# Altium schematic sheet MotoAVC - Aquisição e IHM.SchDoc: MotoAVC v1.0
size A4; Author: Felippe Kalil Mendonça; DrawnBy: Felippe Kalil Mendonça; Organization: LABSOLDA/UFSC; Address1: Campus Universitário; Address2: Trindade - Florianópolis - SC; Address3: Brasil; DocumentNumber: 1.0; SheetNumber: 1; SheetTotal: 1; ProjectName: MotoAVC
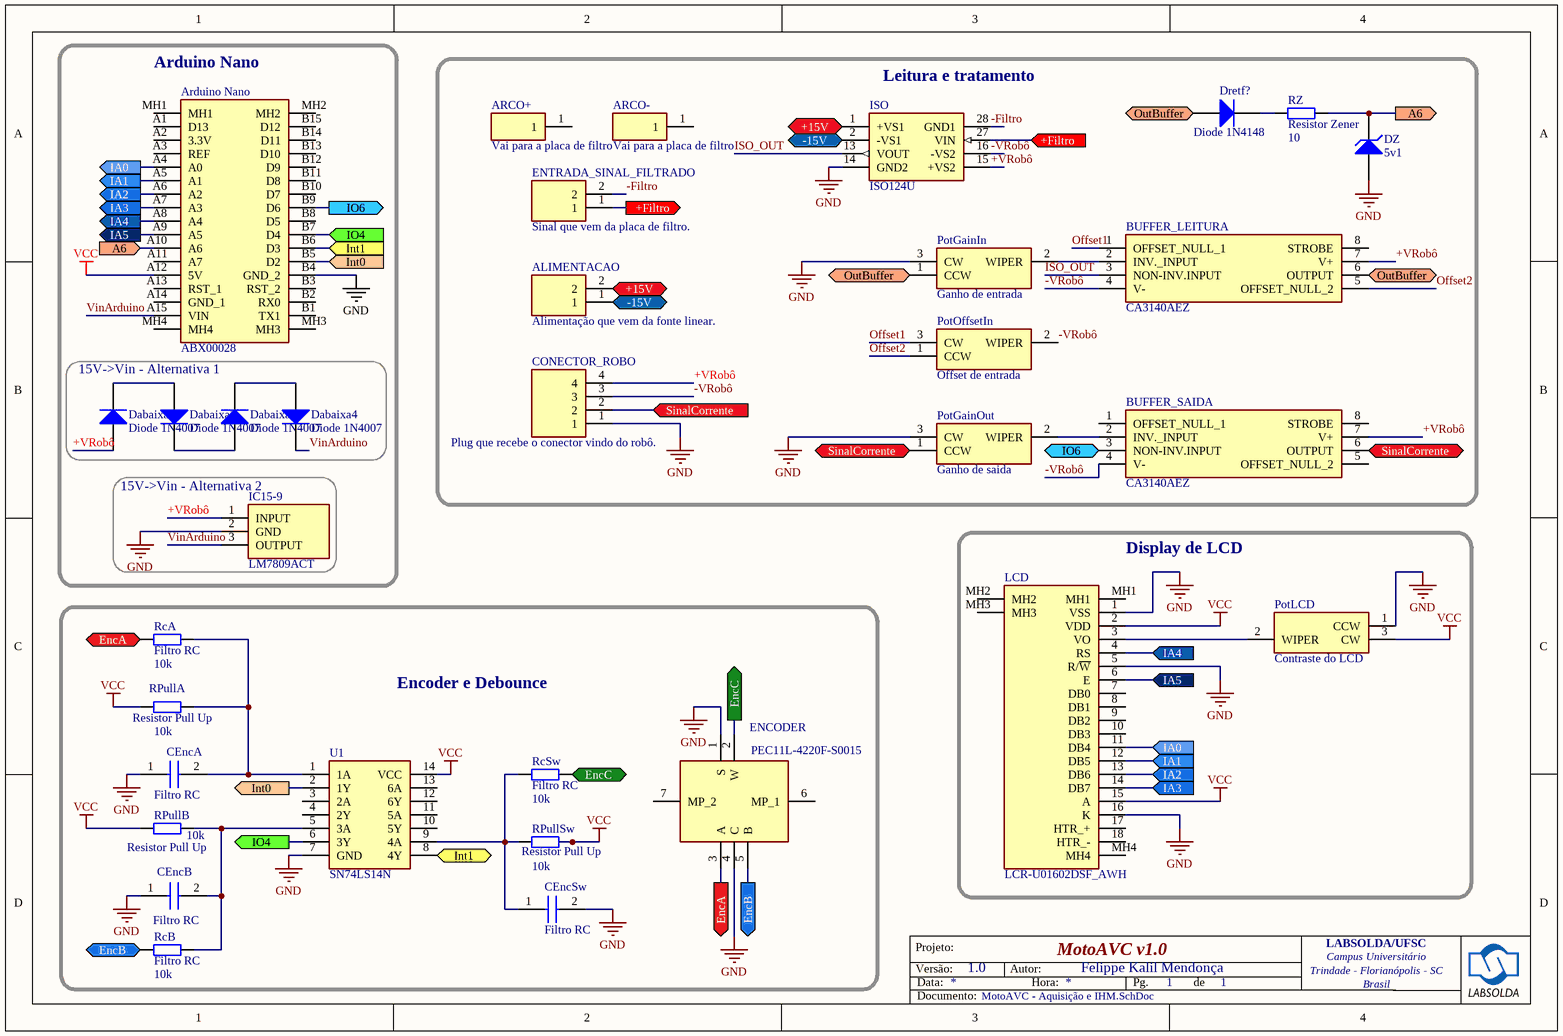
[diagram p0: MotoAVC - Aquisição e IHM.SchDoc]

## Parts
ALIMENTACAO  Alimentação que vem da fonte linear.  [SHDR2W104P0X254_1X2_508X580X1205P]
ARCO+  Vai para a placa de filtro  [CT22320]
ARCO-  Vai para a placa de filtro  [CT22320]
Arduino_Nano  ABX00028  [ABX00028]
BUFFER_LEITURA  CA3140AEZ  [DIP794W56P254L958H533Q8N]
BUFFER_SAIDA  CA3140AEZ  [DIP794W56P254L958H533Q8N]
CEncA  Filtro RC  [R82DC4100DQ60J]
CEncB  Filtro RC  [R82DC4100DQ60J]
CEncSw  Filtro RC  [R82DC4100DQ60J]
CONECTOR_ROBO  Plug que recebe o conector vindo do robô.  [SHDR4W87P0X254_1X4_1001X635X1091P]
Dabaixa1  Diode 1N4007  [DO-41]
Dabaixa2  Diode 1N4007  [DO-41]
Dabaixa3  Diode 1N4007  [DO-41]
Dabaixa4  Diode 1N4007  [DO-41]
Dretf?  Diode 1N4148  [DO-35]
DZ  5v1  [DIODE-0.7]
ENCODER  PEC11L-4220F-S0015  [PEC11L4220FS0015]
ENTRADA_SINAL_FILTRADO  Sinal que vem da placa de filtro.  [SHDR2W104P0X254_1X2_508X580X1205P]
IC15-9  LM7809ACT  [TO254P470X1016X2019-3P]
ISO  ISO124U  [ISO122U]
LCD  LCR-U01602DSF_AWH  [LCRU01602DSFAWH]
PotGainIn  Ganho de entrada  [3386F1153]
PotGainOut  Ganho de saida  [3386F1153]
PotLCD  Contraste do LCD  [3386F1153]
PotOffsetIn  Offset de entrada  [3386F1153]
RcA  Filtro RC  value 10k  [AXIAL-0.4]
RcB  Filtro RC  value 10k  [AXIAL-0.4]
RcSw  Filtro RC  value 10k  [AXIAL-0.4]
RPullA  Resistor Pull Up  value 10k  [AXIAL-0.4]
RPullB  Resistor Pull Up  value 10k  [AXIAL-0.4]
RPullSw  Resistor Pull Up  value 10k  [AXIAL-0.4]
RZ  Resistor Zener  value 10  [AXIAL-0.4]
U1  SN74LS14N  [DIP794W53P254L1930H508Q14N]

## Blocks framed on the sheet
Arduino Nano: Arduino_Nano
Leitura e tratamento: ALIMENTACAO ARCO+ ARCO- BUFFER_LEITURA BUFFER_SAIDA CONECTOR_ROBO Dretf? DZ ENTRADA_SINAL_FILTRADO ISO PotGainIn PotGainOut PotOffsetIn RZ
15V->Vin - Alternativa 1: Dabaixa1-Dabaixa4
15V->Vin - Alternativa 2: IC15-9
Display de LCD: LCD PotLCD
Encoder e Debounce: CEncA CEncB CEncSw ENCODER RcA RcB RcSw RPullA RPullB RPullSw U1

## Ports
+15V (in), +15V (out), +Filtro (in), +Filtro (out), -15V (in), -15V (out), A6 (in), A6 (out), EncA (in), EncA (out), EncB (in), EncB (out), EncC (in), EncC (out), IA0 (in), IA0 (out), IA1 (in), IA1 (out), IA2 (in), IA2 (out), IA3 (in), IA3 (out), IA4 (in), IA4 (out), IA5 (in), IA5 (out), Int0 (in), Int0 (out), Int1 (in), Int1 (out), IO4 (in), IO4 (out), IO6 (in), IO6 (out), OutBuffer (in), OutBuffer (out), SinalCorrente (in), SinalCorrente (out)

## Nets
GND: Arduino_Nano.B4(GND_2) CEncA.1 CEncB.1 CEncSw.2 CONECTOR_ROBO.1 DZ.1(A) ENCODER.1(S) ENCODER.4(C) IC15-9.2(GND) ISO.14(GND2) LCD.1(VSS) LCD.5(R/~{W}) LCD.16(K) PotGainIn.3(CW) PotGainOut.3(CW) PotLCD.1(CCW) U1.7(GND)
VCC: Arduino_Nano.A12(5V) LCD.2(VDD) LCD.15(A) PotLCD.3(CW) RPullA.1 RPullB.1 RPullSw.2 U1.14(VCC)
+15V: ALIMENTACAO.2 ISO.1(+VS1) ; port +15V
+Filtro: ENTRADA_SINAL_FILTRADO.1 ISO.27(VIN) ; port +Filtro
+VRobô: BUFFER_LEITURA.7(V+) BUFFER_SAIDA.7(V+) CONECTOR_ROBO.4 Dabaixa1.1(A) IC15-9.1(INPUT) ISO.15(+VS2)
-15V: ALIMENTACAO.1 ISO.2(-VS1) ; port -15V
-Filtro: ENTRADA_SINAL_FILTRADO.2 ISO.28(GND1)
-VRobô: BUFFER_LEITURA.4(V-) BUFFER_SAIDA.4(V-) CONECTOR_ROBO.3 ISO.16(-VS2) PotOffsetIn.2(WIPER)
A6: Arduino_Nano.A10(A6) DZ.2(K) RZ.2 ; port A6
EncA: ENCODER.3(A) RcA.2 ; port EncA
EncB: ENCODER.5(B) RcB.1 ; port EncB
EncC: ENCODER.2(W) RcSw.2 ; port EncC
IA0: Arduino_Nano.A4(A0) LCD.11(DB4) ; port IA0
IA1: Arduino_Nano.A5(A1) LCD.12(DB5) ; port IA1
IA2: Arduino_Nano.A6(A2) LCD.13(DB6) ; port IA2
IA3: Arduino_Nano.A7(A3) LCD.14(DB7) ; port IA3
IA4: Arduino_Nano.A8(A4) LCD.4(RS) ; port IA4
IA5: Arduino_Nano.A9(A5) LCD.6(E) ; port IA5
Int0: Arduino_Nano.B5(D2) U1.2(1Y) ; port Int0
Int1: Arduino_Nano.B6(D3) U1.8(4Y) ; port Int1
IO4: Arduino_Nano.B7(D4) U1.6(3Y) ; port IO4
IO6: Arduino_Nano.B9(D6) BUFFER_SAIDA.3(NON-INV.INPUT) ; port IO6
ISO_OUT: BUFFER_LEITURA.3(NON-INV.INPUT) ISO.13(VOUT)
Offset1: BUFFER_LEITURA.1(OFFSET_NULL_1) PotOffsetIn.3(CW)
Offset2: BUFFER_LEITURA.5(OFFSET_NULL_2) PotOffsetIn.1(CCW)
OutBuffer: BUFFER_LEITURA.6(OUTPUT) Dretf?.1(A) PotGainIn.1(CCW) ; port OutBuffer
SinalCorrente: BUFFER_SAIDA.6(OUTPUT) CONECTOR_ROBO.2 PotGainOut.1(CCW) ; port SinalCorrente
VinArduino: Arduino_Nano.A15(VIN) Dabaixa4.2(K) IC15-9.3(OUTPUT)
NetBUFFER_LEITURA_2: BUFFER_LEITURA.2(INV._INPUT) PotGainIn.2(WIPER)
NetBUFFER_SAIDA_2: BUFFER_SAIDA.2(INV._INPUT) PotGainOut.2(WIPER)
NetCEncA_2: CEncA.2 RcA.1 RPullA.2 U1.1(1A)
NetCEncB_2: CEncB.2 RcB.2 RPullB.2 U1.5(3A)
NetCEncSw_1: CEncSw.1 RcSw.1 RPullSw.1 U1.9(4A)
NetDabaixa1_2: Dabaixa1.2(K) Dabaixa2.1(A)
NetDabaixa2_2: Dabaixa2.2(K) Dabaixa3.1(A)
NetDabaixa3_2: Dabaixa3.2(K) Dabaixa4.1(A)
NetDretf?_2: Dretf?.2(K) RZ.1
NetLCD_3: LCD.3(VO) PotLCD.2(WIPER)

Not connected (* = marked no-connect by the designer): ARCO+ 1; ARCO- 1; Arduino_Nano A1(D13) A2(3.3V) A3(REF) A11(A7) A13(RST_1) A14(GND_1) B1(TX1) B2(RX0) B3(RST_2) B8(D5) B10(D7) B11(D8) B12(D9) B13(D10) B14(D11) B15(D12) MH1 MH2 MH3 MH4; BUFFER_LEITURA 8(STROBE); BUFFER_SAIDA 1(OFFSET_NULL_1) 5(OFFSET_NULL_2) 8(STROBE); ENCODER 6(MP_1) 7(MP_2); LCD 7(DB0) 8(DB1) 9(DB2) 10(DB3) 17(HTR_+) 18(HTR_-) MH1 MH2 MH3 MH4; U1 3(2A) 4(2Y) 10(5Y) 11(5A) 12(6Y) 13(6A)

## Notes on the sheet
- Versão:
- Projeto:
- Data:
- Autor:
- Hora:
- Pg.
- de
- Documento:

## Library data of the parts
ALIMENTACAO ENTRADA_SINAL_FILTRADO = 0022272021: Connector; Manufacturer_Name: Molex; Datasheet Link: https://www.molex.com/webdocs/datasheets/pdf/en-us/0022272021_PCB_HEADERS.pdf; Height: 12.05mm; Manufacturer_Part_Number: 0022272021; Mouser Part Number: N/A; Mouser Price/Stock: https://www.mouser.com/Search/Refine.aspx?Keyword=N%2FA
ARCO+ ARCO- = CT2232-0: Connector; Manufacturer_Name: Cal Test; Datasheet Link: http://www.caltestelectronics.com/images/attachments/CT2232_drawing.pdf; Height: 38.3mm; Manufacturer_Part_Number: CT2232-0; Mouser Part Number: 510-CT2232-0; Mouser Price/Stock: https://www.mouser.co.uk/ProductDetail/Cal-Test/CT2232-0?qs=vgjKjNJexThptfwlH17E%2Fw%3D%3D
Arduino_Nano = ABX00028: Integrated Circuit; Manufacturer_Name: Arduino; Datasheet Link: https://store.arduino.cc/arduino-nano-every; Height: 10mm; Manufacturer_Part_Number: ABX00028; Mouser Part Number: 782-ABX00028; Mouser Price/Stock: https://www.mouser.co.uk/ProductDetail/Arduino/ABX00028?qs=PzGy0jfpSMtit6rnFl8mVg%3D%3D; RS Part Number: 1927586; RS Price/Stock: http://uk.rs-online.com/web/p/products/1927586
BUFFER_LEITURA BUFFER_SAIDA = CA3140AEZ: Integrated Circuit; Manufacturer_Name: Renesas Electronics; Datasheet Link: https://www.renesas.com/en-us/www/doc/datasheet/ca3140-a.pdf; Height: 5.33mm; Manufacturer_Part_Number: CA3140AEZ; Mouser Part Number: 968-CA3140AEZ; Mouser Price/Stock: https://www.mouser.co.uk/ProductDetail/Renesas-Intersil/CA3140AEZ?qs=cbl4%252BYHJGOHUlWz8IZgCeg%3D%3D; RS Part Number: 9215563P; RS Price/Stock: http://uk.rs-online.com/web/p/products/9215563P
CEncA CEncB CEncSw = R82DC4100DQ60J: Capacitor; Manufacturer_Name: Kemet; Allied_Number: 70037793; Datasheet Link: https://content.kemet.com/datasheets/KEM_F3101_R82.pdf; Height: 10.1mm; Manufacturer_Part_Number: R82DC4100DQ60J; Mouser Part Number: 80-R82DC4100DQ60J; Mouser Price/Stock: https://www.mouser.co.uk/ProductDetail/KEMET/R82DC4100DQ60J?qs=06HLYMEcjuVd2Wr1NUYuhw%3D%3D; RS Part Number: 8708834; RS Price/Stock: http://uk.rs-online.com/web/p/products/8708834; Allied Price/Stock: https://www.alliedelec.com/kemet-r82dc4100dq60j/70037793/
CONECTOR_ROBO = 0022232041: Connector; Manufacturer_Name: Molex; Datasheet Link: http://www.molex.com/pdm_docs/sd/022232041_sd.pdf; Height: 10.91mm; Manufacturer_Part_Number: 0022232041; Mouser Part Number: N/A; Mouser Price/Stock: https://www.mouser.com/Search/Refine.aspx?Keyword=N%2FA
Dabaixa1-Dabaixa4 = Diode 1N4007: 1 Amp General Purpose Rectifier; Published: 8-Jun-2000; LatestRevisionDate: 17-Jul-2002; LatestRevisionNote: Re-released for DXP Platform.; DatasheetVersion: 1998; PackageVersion: Aug-1999; PackageReference: DO-41; Publisher: Altium Limited; PackageDescription: Diode, Axial; Body 5.2 x 2.7 mm (LxDia. max), Lead Dia. 0.86 mm (max); Code_JEDEC: DO-204-AL; ComponentLink1Description: Manufacturer Link; ComponentLink1URL: http://www.fairchildsemi.com/; ComponentLink2Description: Datasheet; ComponentLink2URL: http://www.fairchildsemi.com/ds/1N%2F1N4001.pdf
Dretf? = Diode 1N4148: High Conductance Fast Diode; Published: 8-Jun-2000; LatestRevisionDate: 17-Jul-2002; LatestRevisionNote: Re-released for DXP Platform.; DatasheetVersion: 1997; PackageReference: DO-35; Publisher: Altium Limited; PackageDescription: Diode, Axial; Body 3.8 x 1.9 mm (LxDia. max), Lead Dia. 0.53 mm (max); Code_JEDEC: DO-204-AH; ComponentLink1Description: Manufacturer Link; ComponentLink1URL: http://www.fairchildsemi.com/; ComponentLink2Description: Datasheet; ComponentLink2URL: http://www.fairchildsemi.com/ds/1N%2F1N4148.pdf
DZ = D Zener: Zener Diode; Published: 8-Jun-2000; LatestRevisionDate: 17-Jul-2002; LatestRevisionNote: Re-released for DXP Platform.; PackageReference: DIODE-0.7; Publisher: Altium Limited; PackageDescription: Diode, Thru-Hole; 2 Leads; 0.7 in Pin Spacing
ENCODER = PEC11L-4220F-S0015: Undefined or Miscellaneous; Manufacturer_Name: Bourns; Allied_Number: 70230668; Datasheet Link: https://www.bourns.com/PDFs/pec11l.pdf; Height: 25mm; Manufacturer_Part_Number: PEC11L-4220F-S0015; Mouser Part Number: 652-PEC11L4220FS0015; Mouser Price/Stock: https://www.mouser.co.uk/ProductDetail/Bourns/PEC11L-4220F-S0015?qs=Q4nXA9D1WFOSxqK3IduBbA%3D%3D; Allied Price/Stock: https://www.alliedelec.com/bourns-pec11l-4220f-s0015/70230668/
IC15-9 = LM7809ACT: Integrated Circuit; Manufacturer_Name: ON Semiconductor; Datasheet Link: https://www.mouser.com/datasheet/2/308/LM7809A-1306765.pdf; Height: 4.7mm; Manufacturer_Part_Number: LM7809ACT; Mouser Part Number: 512-LM7809ACT; Mouser Price/Stock: https://www.mouser.co.uk/ProductDetail/ON-Semiconductor-Fairchild/LM7809ACT?qs=VOMQJJE%252BBNnUX5YOd5%2Fz3w%3D%3D; RS Part Number: 8062845; RS Price/Stock: http://uk.rs-online.com/web/p/products/8062845
ISO = ISO124U: Integrated Circuit; Manufacturer_Name: Texas Instruments; Datasheet Link: http://www.ti.com/lit/ds/symlink/iso124.pdf; Height: 2.65mm; Manufacturer_Part_Number: ISO124U; Mouser Part Number: 595-ISO124U; Mouser Price/Stock: https://www.mouser.co.uk/ProductDetail/Texas-Instruments/ISO124U?qs=VBduBm9rCJQZw7ykoQ%2Fz8g%3D%3D; RS Part Number: 3008259P; RS Price/Stock: http://uk.rs-online.com/web/p/products/3008259P
LCD = LCR-U01602DSF_AWH: Display; Manufacturer_Name: Lumex; Manufacturer_Part_Number: LCR-U01602DSF/AWH; Allied_Number: 70127475; Datasheet Link: http://www.mouser.com/datasheet/2/244/LCR-U01602DSF_A-WH-1176207.pdf; Height: 12.8mm; Mouser Part Number: 696-LCR-U01602DSFAWH; Mouser Price/Stock: https://www.mouser.co.uk/ProductDetail/Lumex/LCR-U01602DSF-AWH?qs=kusUAj%252B7tT8a8%252BlV07AHzQ%3D%3D; RS Part Number: 8885745; RS Price/Stock: http://uk.rs-online.com/web/p/products/8885745; Allied Price/Stock: https://www.alliedelec.com/lumex-lcr-u01602dsf-awh/70127475/
PotGainIn PotGainOut PotLCD PotOffsetIn = 3386F-1-103LF: Variable Resistor; Manufacturer_Name: Bourns; Allied_Number: 70154071; Datasheet Link: https://www.bourns.com/pdfs/3386.pdf; Height: 4.83mm; Manufacturer_Part_Number: 3386F-1-103LF; Mouser Part Number: 652-3386F-1-103LF; Mouser Price/Stock: https://www.mouser.co.uk/ProductDetail/Bourns/3386F-1-103LF?qs=nE0RJHjSZ6Uy1E1G8svoHg%3D%3D; RS Part Number: 5222227P; RS Price/Stock: http://uk.rs-online.com/web/p/products/5222227P; Allied Price/Stock: http://www.alliedelec.com/bourns-3386f-1-103lf/70154071/
RcA RcB RcSw RPullA RPullB RPullSw RZ = Res2: Resistor; Published: 8-Jun-2000; LatestRevisionDate: 17-Jul-2002; LatestRevisionNote: Re-released for DXP Platform.; PackageReference: AXIAL-0.4; Publisher: Altium Limited; PackageDescription: Axial Device, Thru-Hole; 2 Leads; 0.4 in Pin Spacing
U1 = SN74LS14N: Integrated Circuit; Manufacturer_Name: Texas Instruments; Datasheet Link: http://www.ti.com/lit/gpn/sn74ls14; Height: 5.08mm; Manufacturer_Part_Number: SN74LS14N; Mouser Part Number: 595-SN74LS14N; Mouser Price/Stock: https://www.mouser.co.uk/ProductDetail/Texas-Instruments/SN74LS14N?qs=fvkeCqCHl3BcDzVDMymKLg%3D%3D; RS Part Number: 0307547P; RS Price/Stock: http://uk.rs-online.com/web/p/products/0307547P